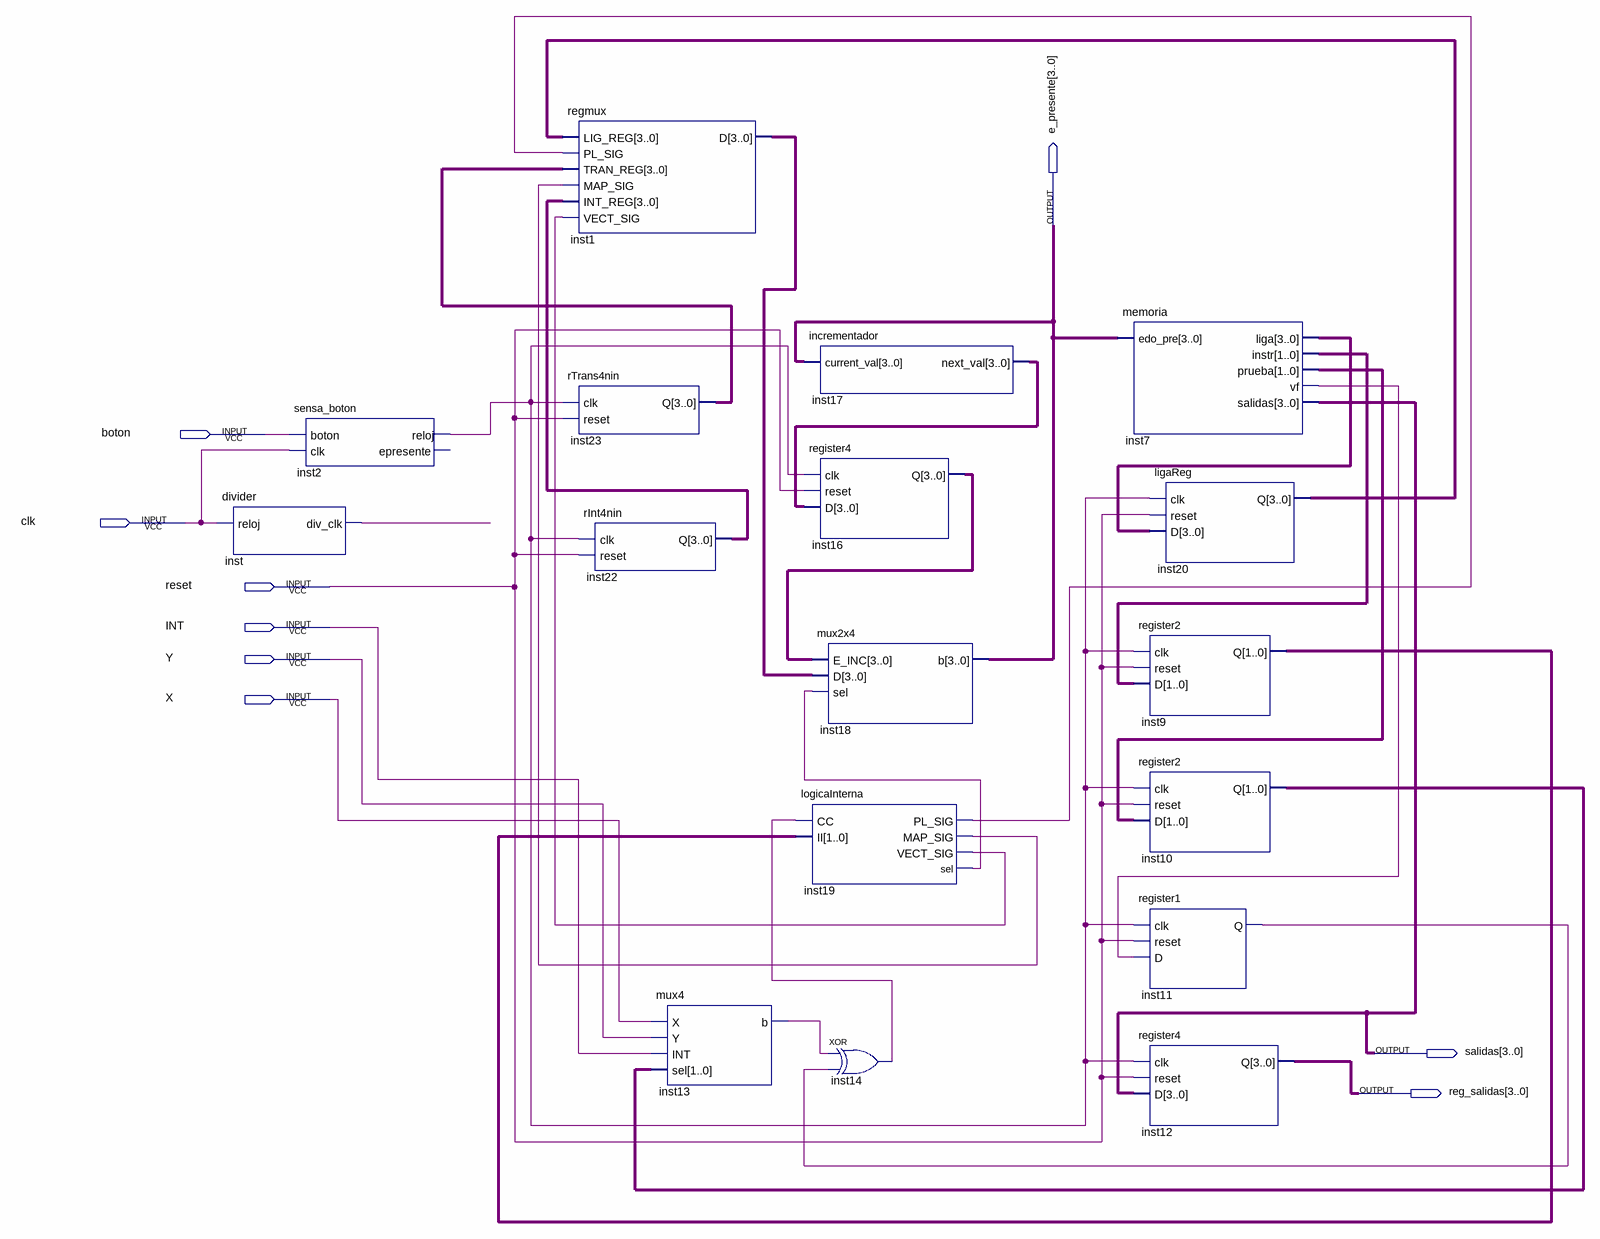
[diagram p0: schematic sheet]
// Quartus schematic Practica4.bdf as structural Verilog: 17 symbols, 9 pins
module Practica4 (
  input  boton,
  input  clk,
  input  reset,
  input  INT,
  input  Y,
  input  X,
  output [3:0] e_presente,
  output [3:0] salidas,
  output [3:0] reg_salidas
);

  wire inst2_reloj, inst7_vf, inst11_q, inst13_b, inst14_out, inst19_map_sig, inst19_pl_sig, inst19_sel,
       inst19_vect_sig, inst_div_clk;
  wire [1:0] inst7_instr, inst7_prueba, inst9_q, inst10_q;
  wire [3:0] inst1_d, inst7_liga, inst16_q, inst17_next_val, inst20_q, inst22_q, inst23_q;

  divider inst (.reloj(clk), .div_clk(inst_div_clk));
  sensa_boton inst2 (.boton(boton), .clk(clk), .reloj(inst2_reloj));  // open: epresente
  regmux inst1 (
    .LIG_REG(inst20_q), .PL_SIG(inst19_pl_sig), .TRAN_REG(inst23_q), .MAP_SIG(inst19_map_sig),
    .INT_REG(inst22_q), .VECT_SIG(inst19_vect_sig), .D(inst1_d));
  rTrans4nin inst23 (.clk(inst2_reloj), .reset(reset), .Q(inst23_q));
  rInt4nin inst22 (.clk(inst2_reloj), .reset(reset), .Q(inst22_q));
  mux4 inst13 (.X(X), .Y(Y), .INT(INT), .sel(inst10_q), .b(inst13_b));
  incrementador inst17 (.current_val(e_presente), .next_val(inst17_next_val));
  register4 inst16 (.clk(inst2_reloj), .reset(reset), .D(inst17_next_val), .Q(inst16_q));
  logicaInterna inst19 (
    .CC(inst14_out), .II(inst9_q), .PL_SIG(inst19_pl_sig), .MAP_SIG(inst19_map_sig),
    .VECT_SIG(inst19_vect_sig), .sel(inst19_sel));
  mux2x4 inst18 (.E_INC(inst16_q), .D(inst1_d), .sel(inst19_sel), .b(e_presente));
  xor inst14 (inst14_out, inst13_b, inst11_q);
  memoria inst7 (
    .edo_pre(e_presente), .liga(inst7_liga), .instr(inst7_instr), .prueba(inst7_prueba), .vf(inst7_vf),
    .salidas(salidas));
  ligaReg inst20 (.clk(inst2_reloj), .reset(reset), .D(inst7_liga), .Q(inst20_q));
  register2 inst9 (.clk(inst2_reloj), .reset(reset), .D(inst7_instr), .Q(inst9_q));
  register2 inst10 (.clk(inst2_reloj), .reset(reset), .D(inst7_prueba), .Q(inst10_q));
  register1 inst11 (.clk(inst2_reloj), .reset(reset), .D(inst7_vf), .Q(inst11_q));
  register4 inst12 (.clk(inst2_reloj), .reset(reset), .D(salidas), .Q(reg_salidas));
endmodule
